# EAGLE schematic TP-DownHole-No2_Alternative (EAGLE 8.2.2)
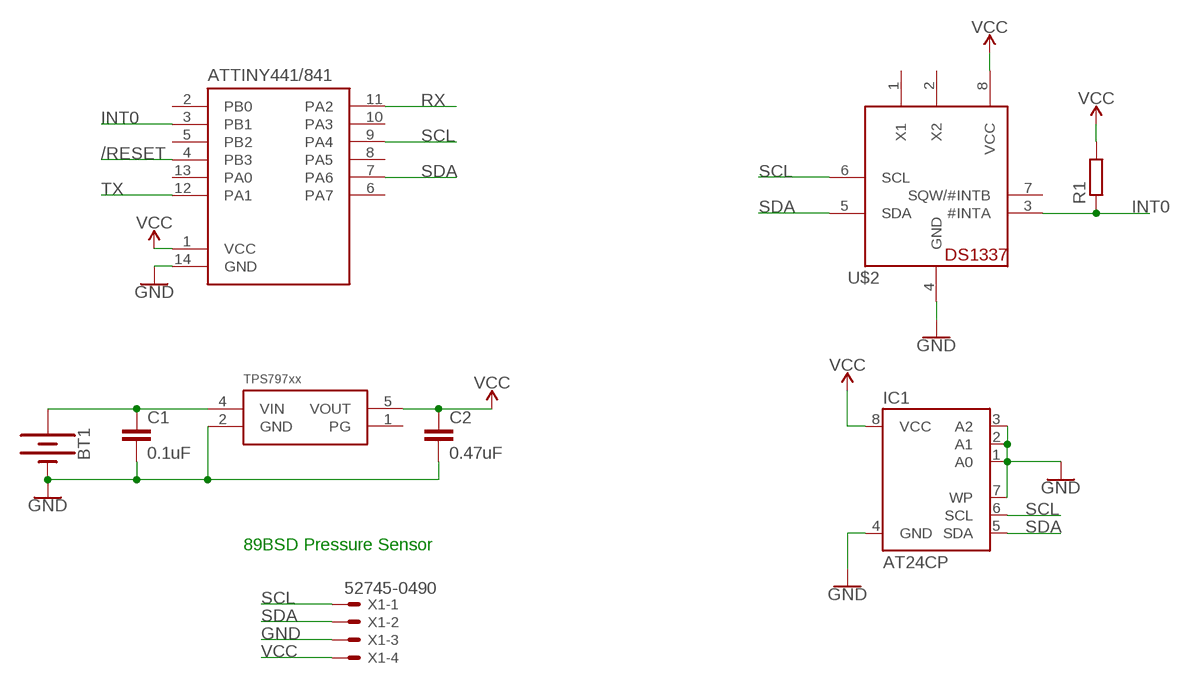
[diagram p0: schematic, sheet 1]

## Parts
BT1  BATTERY-12MM_SMD  [BATTCON_12MM]
C1  0.1uF  C-EUC0603  [C0603]
C2  0.47uF  C-EUC0603  [C0603]
IC1  AT24CP  [DIL08]
R1  R-EU_R0603  [R0603]
U$1  ATTINY441/841  [SOIC_14]
U$2  DS1337  [DIL08-ROUND]
U$3  TPS797XX  [DCK_R-PDSO-G5]
X1  52745-0490  [52745-0490]

## Nets
/RESET: U$1.4(PB3)
GND: BT1.GND(-) C1.2 C2.2 IC1.1(A0) IC1.2(A1) IC1.3(A2) IC1.4(GND) IC1.7(WP) U$1.14(GND) U$2.4(GND) U$3.2(GND) X1.3
INT0: R1.1 U$1.3(PB1) U$2.3(#INTA)
N$1: BT1.PWR@1(+) C1.1 U$3.4(VIN)
RX: U$1.11(PA2)
SCL: IC1.6(SCL) U$1.9(PA4) U$2.6(SCL) X1.1
SDA: IC1.5(SDA) U$1.7(PA6) U$2.5(SDA) X1.2
TX: U$1.12(PA1)
VCC: C2.1 IC1.8(VCC) R1.2 U$1.1(VCC) U$2.8(VCC) U$3.5(VOUT) X1.4
Unconnected: U$1.2(PB0) U$1.5(PB2) U$1.6(PA7) U$1.8(PA5) U$1.10(PA3) U$1.13(PA0) U$2.1(X1) U$2.2(X2) U$2.7(SQW/#INTB) U$3.1(PG)

## Notes on the sheet
- 89BSD Pressure Sensor

## Library data of the parts
BT1 = SparkFun-Batteries:BATTERY: Battery - Single Cell A variety of battery chemistries, sizes, and footprints. Device List: 20MM_PTH - Coin Cell Battery Holder - 20mm (PTH) <https://www.sparkfun.com/products/783> 12MM_SMD - Coin Cell Battery Holder - 12mm (SMD) <https://www.sparkfun.com/products/10592> 12MM_PTH - Coin Cell Battery Holder - 12mm (PTH) <https://www.sparkfun.com/products/7948> 20MM_SMD - 20mm Coin Cell Battery Holder (SMD) (2 legs) Used on the Big Time Watch Kit <https://www.sparkfun.com/products/11734> 20MM_SMD_4LEGS - Coin Cell Battery Holder - 20mm (SMD) <https://www.sparkfun.com/products/11892> 20MM_SMD_4LEGS_OVERPASTE - Coin Cell Battery Holder - 20mm (SMD) <https://www.sparkfun.com/products/11892> (Over-paste on the legs) 24.5MM_PTH - Coin Cell Battery Holder - 24.5mm (PTH) <https://www.sparkfun.com/products/8863> 9V - 9V Battery Holder - PC Mount Used on the SparkFun SparkPunk Sound Kit <https://www.sparkfun.com/products/11177> and SparkFun SparkPunk Sequencer Kit <https://www.sparkfun.com/products/12707> 18650 - Battery Holder - 18650 (PTH) <https://www.sparkfun.com/products/13113> AA - Battery Holder - 1xAA (PTH) <https://www.sparkfun.com/products/7949> AAA - Battery Holder - 1xAAA (PTH) <https://www.sparkfun.com/products/12718> AA_KIT - Battery Holder - 1xAA (PTH) <https://www.sparkfun.com/products/7949> Special kit package - pads only have exposed copper on one side of the board. AAA_KIT - Battery Holder - 1xAAA (PTH) <https://www.sparkfun.com/products/12718> Special kit package - pads only have exposed copper on one side of the board.; PROD_ID: BATT-08044; SF_SKU: PRT-10592
C1 C2 = rcl:C-EU: CAPACITOR, European symbol
IC1 = atmel:AT24C*: 2-wire serial EEPROM; MPN: AT24C1024BW-SH-B; OC_FARNELL: 1362646; OC_NEWARK: 03P2044
R1 = rcl:R-EU_: RESISTOR, European symbol
U$1 = Custom:ATTINY441/841: ATTINY441, ATTINY841 8 bit MCU, 4/8k flash, 256/512B SRAM
U$2 = adafruit:DS1337: DS1337 - Maxim RTC without battery backup
U$3 = Custom:TPS797XX: TPS797xx, Ultra low power linear voltage regulator, fixed voltages of 1.8v, 3v, 3.3v Input voltage rage of 1.8-5.5v
X1 = con-molex:52745-0490: FFC/FPC-to-Board 0.50mm (.020") SMT Top Contact Right Angle, ZIF, Style Receptacle 52745 / 52435 Source: http://www.molex.com/product/ffc/52745.html; MPN: 52745-0490; OC_FARNELL: unknown; OC_NEWARK: 61H4699